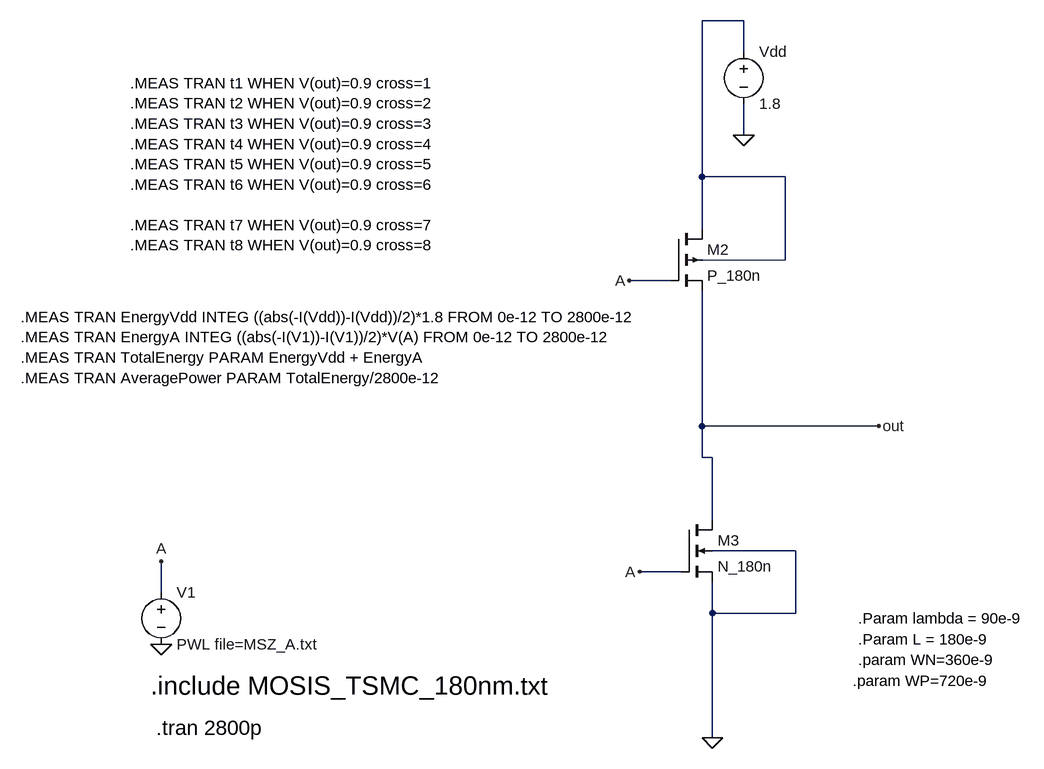
[diagram p0: schematic Inverter_180nm.asc]
Inverter_180nm.asc, the LTspice schematic file:
Version 4
SHEET 1 880 680
WIRE -1056 -752 -1120 -752
WIRE -1056 -704 -1056 -752
WIRE -1056 -576 -1056 -624
WIRE -1120 -512 -1120 -752
WIRE -992 -512 -1120 -512
WIRE -1120 -432 -1120 -512
WIRE -992 -384 -992 -512
WIRE -992 -384 -1120 -384
WIRE -1168 -352 -1232 -352
WIRE -1120 -128 -1120 -336
WIRE -848 -128 -1120 -128
WIRE -1120 -80 -1120 -128
WIRE -1104 -80 -1120 -80
WIRE -1104 16 -1104 -80
WIRE -976 64 -1104 64
WIRE -1152 96 -1216 96
WIRE -1952 128 -1952 80
WIRE -1104 160 -1104 112
WIRE -976 160 -976 64
WIRE -976 160 -1104 160
WIRE -1104 352 -1104 160
FLAG -1952 208 0
FLAG -1952 80 A
FLAG -1104 352 0
FLAG -848 -128 out
FLAG -1216 96 A
FLAG -1232 -352 A
FLAG -1056 -576 0
SYMBOL voltage -1952 112 R0
WINDOW 123 0 0 Left 0
WINDOW 39 0 0 Left 0
SYMATTR InstName V1
SYMATTR Value PWL file=MSZ_A.txt
SYMBOL voltage -1056 -720 R0
SYMATTR InstName Vdd
SYMATTR Value 1.8
SYMBOL pmos4 -1168 -432 R0
SYMATTR InstName M2
SYMATTR Value P_180n
SYMATTR Value2 l={L} w={WP} ad={5*lambda*WP} as={5*lambda*WP} pd={10*lambda+2*WP} ps={10*lambda+2*WP}
SYMBOL nmos4 -1152 16 R0
SYMATTR InstName M3
SYMATTR Value N_180n
SYMATTR Value2 l={L} w={WN} ad={5*lambda*WN} as={5*lambda*WN} pd={10*lambda + 2*WN} ps={10*lambda + 2*WN}
TEXT -1960 336 Left 3 !.tran 2800p
TEXT -1968 272 Left 4 !.include MOSIS_TSMC_180nm.txt
TEXT -880 168 Left 2 !.Param lambda = 90e-9
TEXT -880 200 Left 2 !.Param L = 180e-9
TEXT -880 232 Left 2 !.param WN=360e-9
TEXT -888 264 Left 2 !.param WP=720e-9
TEXT -2000 -656 Left 2 !.MEAS TRAN t1 WHEN V(out)=0.9 cross=1\n.MEAS TRAN t2 WHEN V(out)=0.9 cross=2\n.MEAS TRAN t3 WHEN V(out)=0.9 cross=3\n.MEAS TRAN t4 WHEN V(out)=0.9 cross=4\n.MEAS TRAN t5 WHEN V(out)=0.9 cross=5\n.MEAS TRAN t6 WHEN V(out)=0.9 cross=6\n \n.MEAS TRAN t7 WHEN V(out)=0.9 cross=7\n.MEAS TRAN t8 WHEN V(out)=0.9 cross=8
TEXT -2168 -296 Left 2 !.MEAS TRAN EnergyVdd INTEG ((abs(-I(Vdd))-I(Vdd))/2)*1.8 FROM 0e-12 TO 2800e-12\n.MEAS TRAN EnergyA INTEG ((abs(-I(V1))-I(V1))/2)*V(A) FROM 0e-12 TO 2800e-12\n.MEAS TRAN TotalEnergy PARAM EnergyVdd + EnergyA\n.MEAS TRAN AveragePower PARAM TotalEnergy/2800e-12

The netlist it stands for:
* Inverter_180nm.asc
V1 A 0 PWL file=MSZ_A.txt
Vdd N001 0 1.8
M2 N001 A out N001 P_180n l={L} w={WP} ad={5*lambda*WP} as={5*lambda*WP} pd={10*lambda+2*WP} ps={10*lambda+2*WP}
M3 out A 0 0 N_180n l={L} w={WN} ad={5*lambda*WN} as={5*lambda*WN} pd={10*lambda + 2*WN} ps={10*lambda + 2*WN}
.model NMOS NMOS
.model PMOS PMOS
.lib standard.mos
.tran 2800p
.include MOSIS_TSMC_180nm.txt
.Param lambda = 90e-9
.Param L = 180e-9
.param WN=360e-9
.param WP=720e-9
.MEAS TRAN t1 WHEN V(out)=0.9 cross=1
.MEAS TRAN t2 WHEN V(out)=0.9 cross=2
.MEAS TRAN t3 WHEN V(out)=0.9 cross=3
.MEAS TRAN t4 WHEN V(out)=0.9 cross=4
.MEAS TRAN t5 WHEN V(out)=0.9 cross=5
.MEAS TRAN t6 WHEN V(out)=0.9 cross=6
.MEAS TRAN t7 WHEN V(out)=0.9 cross=7
.MEAS TRAN t8 WHEN V(out)=0.9 cross=8
.MEAS TRAN EnergyVdd INTEG ((abs(-I(Vdd))-I(Vdd))/2)*1.8 FROM 0e-12 TO 2800e-12
.MEAS TRAN EnergyA INTEG ((abs(-I(V1))-I(V1))/2)*V(A) FROM 0e-12 TO 2800e-12
.MEAS TRAN TotalEnergy PARAM EnergyVdd + EnergyA
.MEAS TRAN AveragePower PARAM TotalEnergy/2800e-12
.backanno
.end

* Results of the author's LTspice run, read from the files saved beside the schematic
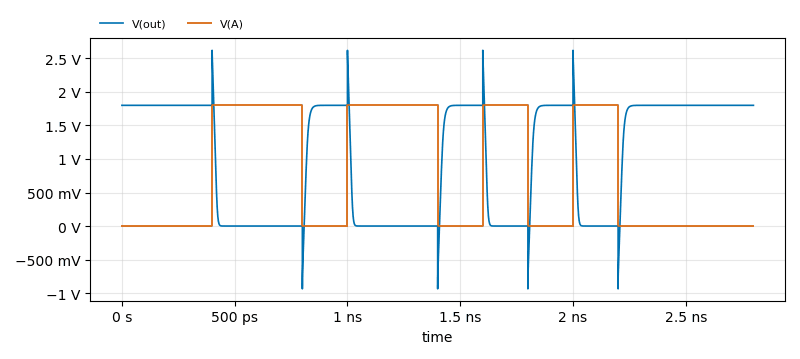
[diagram p1: Transient Analysis of Inverter_180nm.asc, plotted from the saved traces]
* Transient Analysis, 1 run:
*   V(out): min -936.2 mV, max 2.62 V, average 1.02 V, rms 1.348 V, last 1.8 V
*   V(A): min 0 V, max 1.8 V, average 771.4 mV, rms 1.178 V, last 0 V